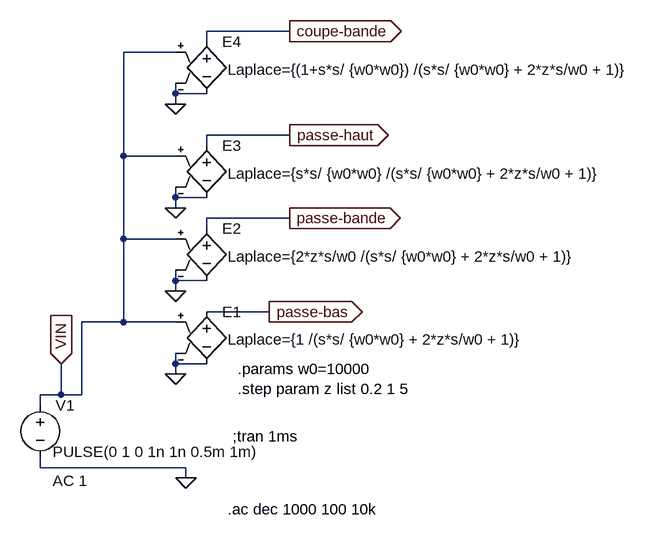
[diagram p0: schematic laplace_2nd_ordre.asc]
laplace_2nd_ordre.asc, the LTspice schematic file:
Version 4
SHEET 1 1232 692
WIRE 640 -208 512 -208
WIRE 512 -192 512 -208
WIRE 464 -176 384 -176
WIRE 464 -112 464 -128
WIRE 512 -112 464 -112
WIRE 464 -96 464 -112
WIRE 640 -48 512 -48
WIRE 512 -32 512 -48
WIRE 384 -16 384 -176
WIRE 464 -16 384 -16
WIRE 464 48 464 32
WIRE 512 48 464 48
WIRE 464 64 464 48
WIRE 640 80 512 80
WIRE 512 96 512 80
WIRE 384 112 384 -16
WIRE 464 112 384 112
WIRE 464 176 464 160
WIRE 512 176 464 176
WIRE 464 192 464 176
WIRE 608 224 512 224
WIRE 384 240 384 112
WIRE 384 240 320 240
WIRE 464 240 384 240
WIRE 464 304 464 288
WIRE 512 304 464 304
WIRE 464 320 464 304
WIRE 288 352 288 304
WIRE 288 352 256 352
WIRE 320 352 320 240
WIRE 320 352 288 352
WIRE 256 368 256 352
WIRE 256 464 256 448
WIRE 480 464 256 464
WIRE 480 480 480 464
FLAG 480 480 0
FLAG 288 304 VIN
IOPIN 288 304 In
FLAG 464 320 0
FLAG 608 224 passe-bas
IOPIN 608 224 Out
FLAG 464 192 0
FLAG 640 80 passe-bande
IOPIN 640 80 Out
FLAG 464 64 0
FLAG 640 -48 passe-haut
IOPIN 640 -48 Out
FLAG 464 -96 0
FLAG 640 -208 coupe-bande
IOPIN 640 -208 Out
SYMBOL voltage 256 352 R0
WINDOW 3 19 88 Left 0
WINDOW 123 19 132 Left 0
WINDOW 39 0 0 Left 0
SYMATTR Value PULSE(0 1 0 1n 1n 0.5m 1m)
SYMATTR Value2 AC 1
SYMATTR InstName V1
SYMBOL e 512 208 R0
WINDOW 3 32 59 Left 0
SYMATTR Value Laplace={1 /(s*s/ {w0*w0} + 2*z*s/w0 + 1)}
SYMATTR InstName E1
SYMBOL e 512 80 R0
WINDOW 3 32 59 Left 0
SYMATTR Value Laplace={2*z*s/w0 /(s*s/ {w0*w0} + 2*z*s/w0 + 1)}
SYMATTR InstName E2
SYMBOL e 512 -48 R0
WINDOW 3 32 59 Left 0
SYMATTR Value Laplace={s*s/ {w0*w0} /(s*s/ {w0*w0} + 2*z*s/w0 + 1)}
SYMATTR InstName E3
SYMBOL e 512 -208 R0
WINDOW 3 32 59 Left 0
SYMATTR Value Laplace={(1+s*s/ {w0*w0}) /(s*s/ {w0*w0} + 2*z*s/w0 + 1)}
SYMATTR InstName E4
TEXT 544 528 Left 0 !.ac dec 1000 100 10k
TEXT 552 416 Left 0 !;tran 1ms
TEXT 560 312 Left 0 !.params w0=10000\n.step param z list 0.2 1 5

The netlist it stands for:
* laplace_2nd_ordre.asc
V1 VIN 0 PULSE(0 1 0 1n 1n 0.5m 1m) AC 1
E1 passe-bas 0 VIN 0 Laplace={1 /(s*s/ {w0*w0} + 2*z*s/w0 + 1)}
E2 passe-bande 0 VIN 0 Laplace={2*z*s/w0 /(s*s/ {w0*w0} + 2*z*s/w0 + 1)}
E3 passe-haut 0 VIN 0 Laplace={s*s/ {w0*w0} /(s*s/ {w0*w0} + 2*z*s/w0 + 1)}
E4 coupe-bande 0 VIN 0 Laplace={(1+s*s/ {w0*w0}) /(s*s/ {w0*w0} + 2*z*s/w0 + 1)}
.ac dec 1000 100 10k
;tran 1ms
.params w0=10000
.step param z list 0.2 1 5
.backanno
.end